# Altium schematic sheet A.SchDoc
size A2
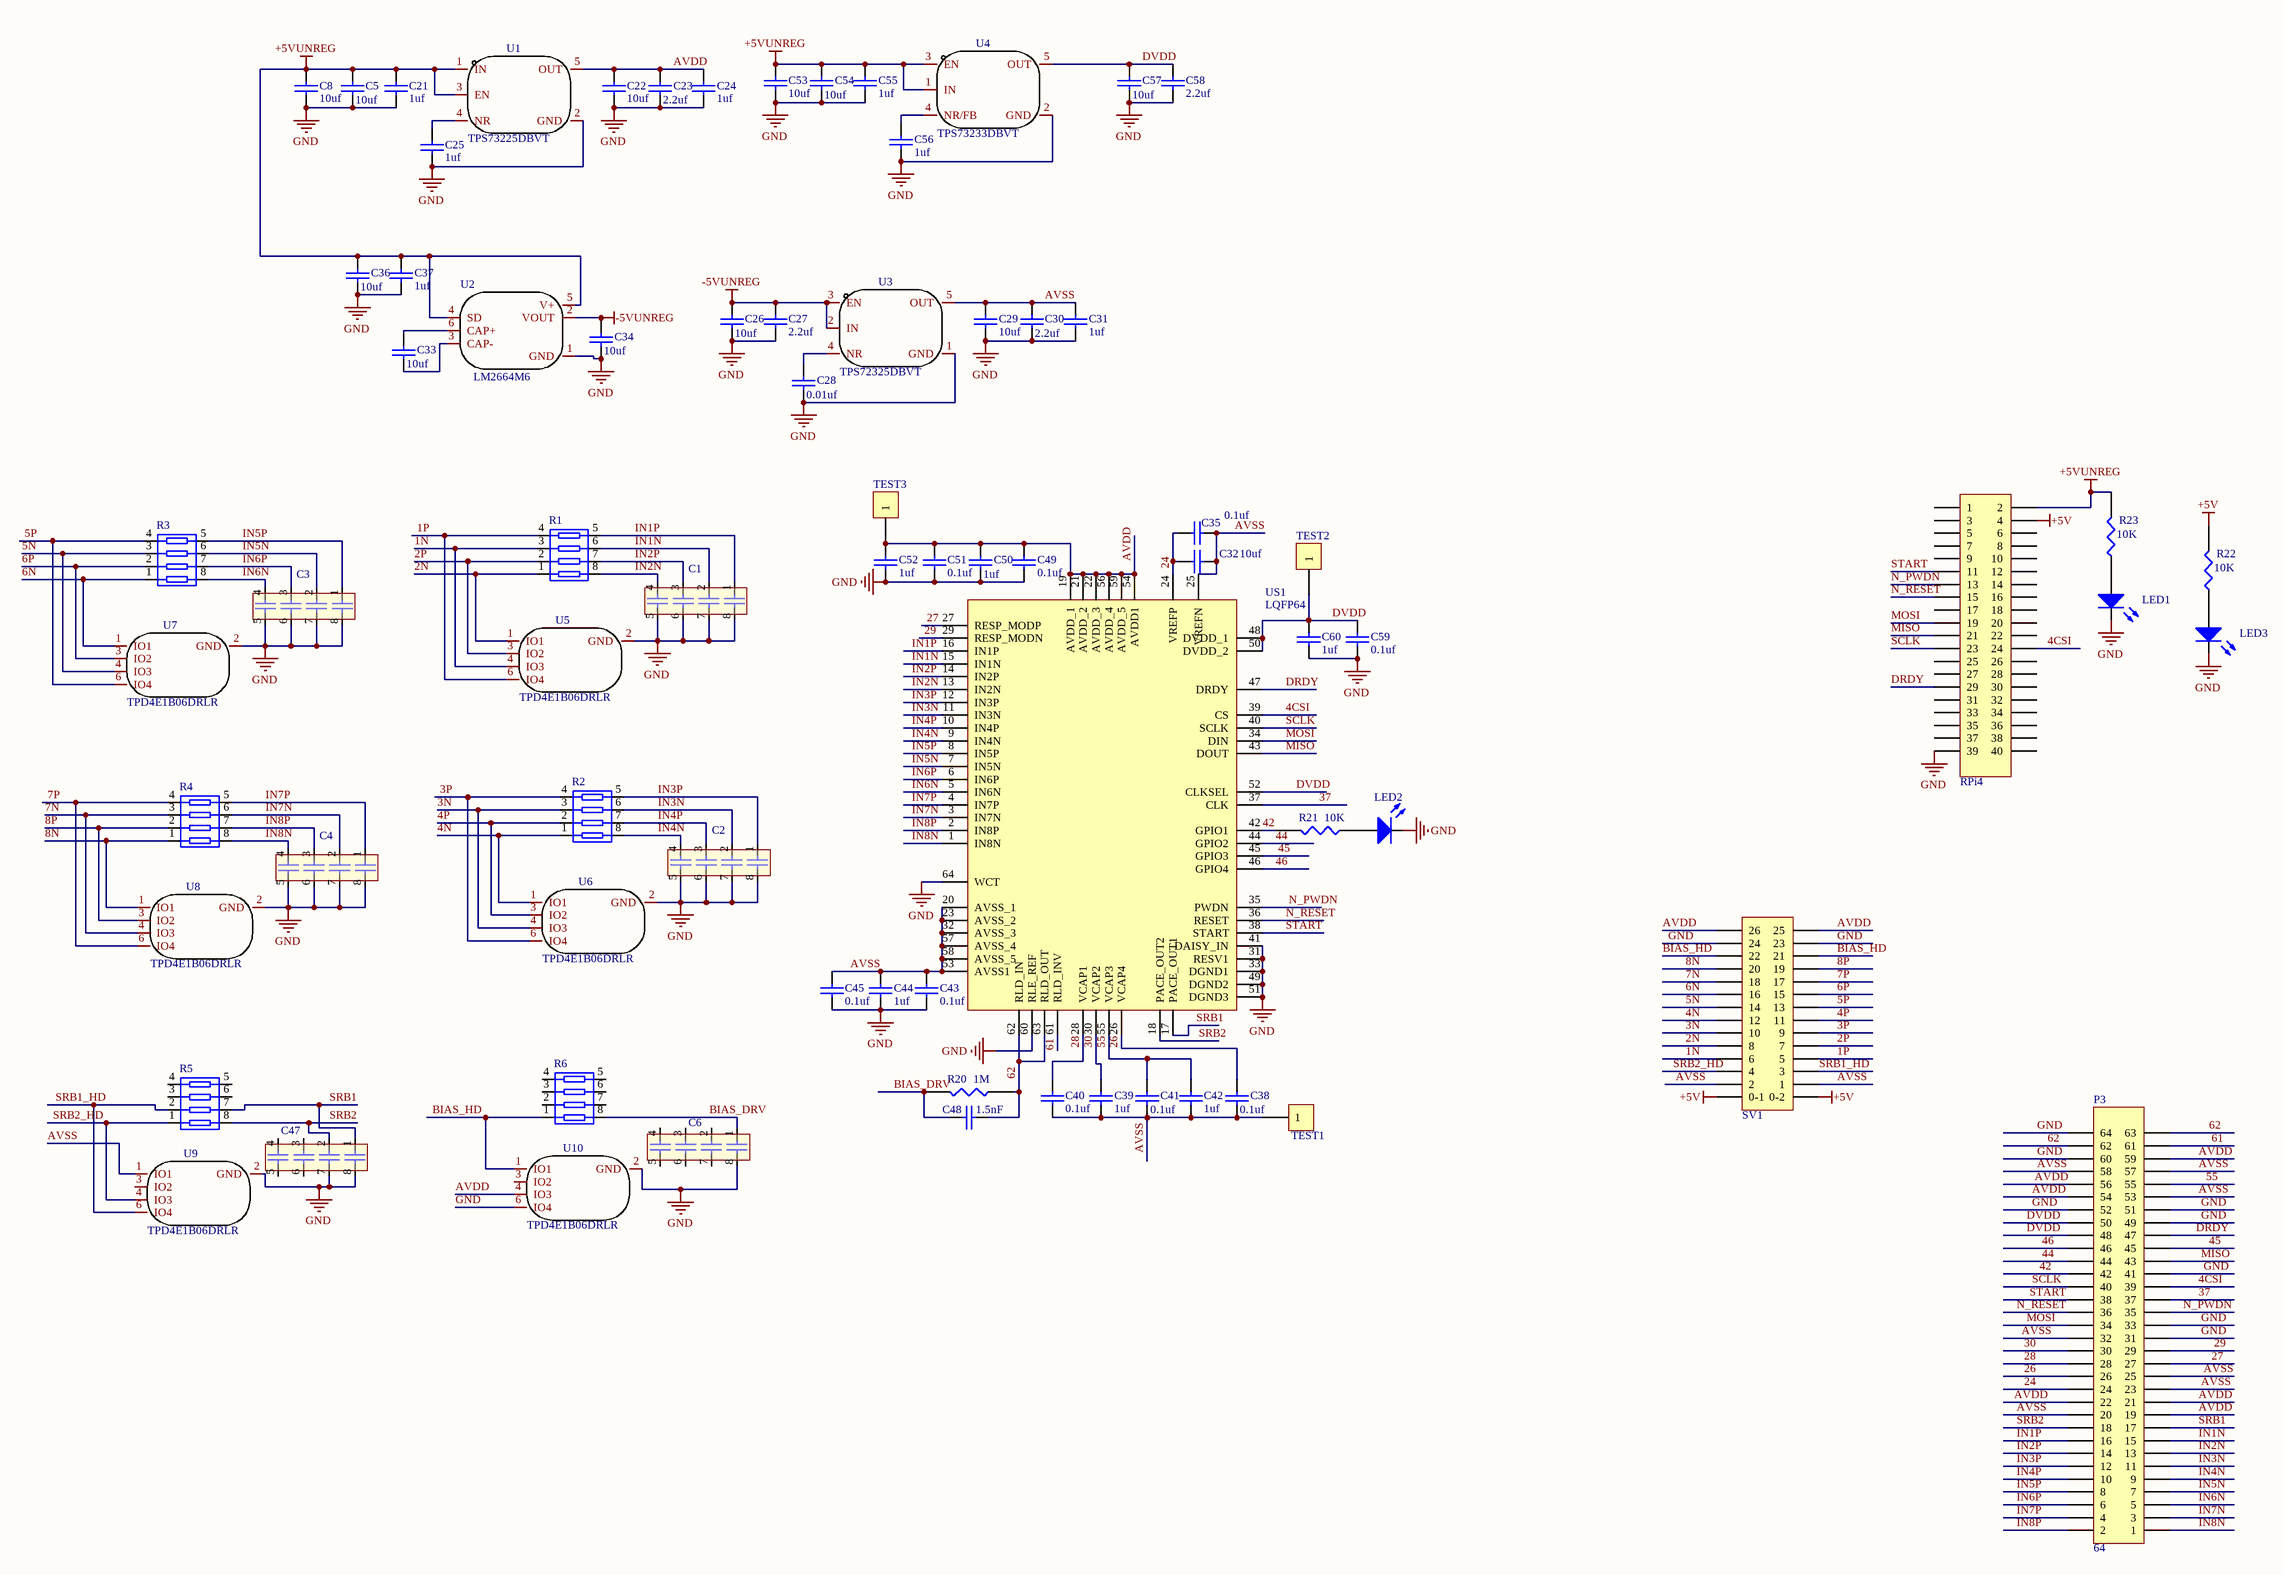
[diagram p0: A.SchDoc]

## Parts
C1  (no value)  [0805 array]
C2  (no value)  [0805 array]
C3  (no value)  [0805 array]
C4  (no value)  [0805 array]
C5  10uf  [0805]
C6  (no value)  [0805 array]
C8  10uf  [0805]
C21  1uf  [0805]
C22  10uf  [0805]
C23  2.2uf  [0805]
C24  1uf  [0805]
C25  1uf  [0805]
C26  10uf  [0805]
C27  2.2uf  [0805]
C28  0.01uf  [0805]
C29  10uf  [0805]
C30  2.2uf  [0805]
C31  1uf  [0805]
C32  10uf  [0805]
C33  10uf  [0805]
C34  10uf  [0805]
C35  0.1uf  [0805]
C36  10uf  [0805]
C37  1uf  [0805]
C38  0.1uf  [0805]
C39  1uf  [0805]
C40  0.1uf  [0805]
C41  0.1uf  [0805]
C42  1uf  [0805]
C43  0.1uf  [0805]
C44  1uf  [0805]
C45  0.1uf  [0805]
C47  (no value)  [0805 array]
C48  1.5nF  [0805]
C49  0.1uf  [0805]
C50  1uf  [0805]
C51  0.1uf  [0805]
C52  1uf  [0805]
C53  10uf  [0805]
C54  10uf  [0805]
C55  1uf  [0805]
C56  1uf  [0805]
C57  10uf  [0805]
C58  2.2uf  [0805]
C59  0.1uf  [0805]
C60  1uf  [0805]
LED1  (no value)  [0805]
LED2  (no value)  [0805]
LED3  (no value)  [0805]
P3  64  [64]
R1  (no value)  [8P4R]
R2  (no value)  [8P4R]
R3  (no value)  [8P4R]
R4  (no value)  [8P4R]
R5  (no value)  [8P4R]
R6  (no value)  [8P4R]
R20  1M  [0805]
R21  10K  [0805]
R22  10K  [0805]
R23  10K  [0805]
RPi4  RP13  [40]  (value not drawn)
SV1  SV1  [26]  (value not drawn)
TEST1  TEST2  [P]  (value not drawn)
TEST2  TEST3  [P]  (value not drawn)
TEST3  TEST4  [P]  (value not drawn)
U1  TPS73225DBVT  [sot23-5]
U2  LM2664M6  [sot23-6]
U3  TPS72325DBVT  [sot23-5]
U4  TPS73233DBVT  [sot23-5]
U5  TPD4E1B06DRLR  [sot563]
U6  TPD4E1B06DRLR  [sot563]
U7  TPD4E1B06DRLR  [sot563]
U8  TPD4E1B06DRLR  [sot563]
U9  TPD4E1B06DRLR  [sot563]
U10  TPD4E1B06DRLR  [sot563]
US1  LQFP64  [TQFP64]

## Nets
+5V: R22.2 RPi4.4 SV1.0-1 SV1.0-2
+5VUNREG: C5.1 C8.1 C21.1 C36.1 C37.1 C53.1 C54.1 C55.1 R23.2 RPi4.2 U1.1(IN) U1.3(EN) U2.4(SD) U2.5(V+) U4.1(IN) U4.3(EN)
-5VUNREG: C26.1 C27.1 C34.1 U2.2(VOUT) U3.2(IN) U3.3(EN)
GND: C1.5 C1.6 C1.7 C1.8 C2.5 C2.6 C2.7 C2.8 C3.5 C3.6 C3.7 C3.8 C4.5 C4.6 C4.7 C4.8 C5.2 C6.8 C8.2 C21.2 C22.2 C23.2 C24.2 C25.2 C26.2 C27.2 C28.2 C29.2 C30.2 C31.2 C34.2 C36.2 C37.2 C43.2 C44.2 C45.2 C47.7 C47.8 C49.2 C50.2 C51.2 C52.2 C53.2 C54.2 C55.2 C56.2 C57.2 C58.2 C59.1 C60.2 LED1.2(K) LED2.2(K) LED3.2(K) P3.31 P3.33 P3.41 P3.49 P3.51 P3.52 P3.60 P3.64 RPi4.39 SV1.23 SV1.24 U1.2(GND) U2.1(GND) U3.1(GND) U4.2(GND) U5.2(GND) U6.2(GND) U7.2(GND) U8.2(GND) U9.2(GND) U10.2(GND) U10.6(IO4) US1.31(RESV1) US1.33(DGND1) US1.41(DAISY_IN) US1.49(DGND2) US1.51(DGND3) US1.60(RLE_REF) US1.64(WCT)
1N: R1.3 SV1.6 U5.4(IO3)
1P: R1.4 SV1.5 U5.6(IO4)
2N: R1.1 SV1.8 U5.1(IO1)
2P: R1.2 SV1.7 U5.3(IO2)
3N: R2.3 SV1.10 U6.4(IO3)
3P: R2.4 SV1.9 U6.6(IO4)
4CSI: P3.39 RPi4.24 US1.39(CS)
4N: R2.1 SV1.12 U6.1(IO1)
4P: R2.2 SV1.11 U6.3(IO2)
5N: R3.3 SV1.14 U7.4(IO3)
5P: R3.4 SV1.13 U7.6(IO4)
6N: R3.1 SV1.16 U7.1(IO1)
6P: R3.2 SV1.15 U7.3(IO2)
7N: R4.3 SV1.18 U8.4(IO3)
7P: R4.4 SV1.17 U8.6(IO4)
8N: R4.1 SV1.20 U8.1(IO1)
8P: R4.2 SV1.19 U8.3(IO2)
24: C32.1 C35.2 P3.24 US1.24(VREFP)
26: C38.1 P3.26 US1.26(VCAP4)
27: P3.27 US1.27(RESP_MODP)
28: C40.1 P3.28 US1.28(VCAP1)
29: P3.29 US1.29(RESP_MODN)
30: C39.1 P3.30 US1.30(VCAP2)
37: P3.37 US1.37(CLK)
42: P3.42 R21.2 US1.42(GPIO1)
44: P3.44 US1.44(GPIO2)
45: P3.45 US1.45(GPIO3)
46: P3.46 US1.46(GPIO4)
55: C41.1 C42.1 P3.55 US1.55(VCAP3)
61: P3.61 US1.61(RLD_INV)
62: C48.2 P3.62 P3.63 R20.1 US1.62(RLD_IN) US1.63(RLD_OUT)
AVDD: C22.1 C23.1 C24.1 C49.1 C50.1 C51.1 C52.1 P3.19 P3.21 P3.22 P3.54 P3.56 P3.59 SV1.25 SV1.26 TEST3.1 U1.5(OUT) U10.4(IO3) US1.19(AVDD_1) US1.21(AVDD_2) US1.22(AVDD_3) US1.54(AVDD1) US1.56(AVDD_4) US1.59(AVDD_5)
AVSS: C29.1 C30.1 C31.1 C32.2 C35.1 C38.2 C39.2 C40.2 C41.2 C42.2 C43.1 C44.1 C45.1 P3.20 P3.23 P3.25 P3.32 P3.53 P3.57 P3.58 SV1.1 SV1.2 TEST1.1 U3.5(OUT) U9.1(IO1) US1.20(AVSS_1) US1.23(AVSS_2) US1.25(VREFN) US1.32(AVSS_3) US1.53(AVSS1) US1.57(AVSS_4) US1.58(AVSS_5)
BIAS_DRV: C6.1 C48.1 R6.8 R20.2
BIAS_HD: R6.1 SV1.21 SV1.22 U10.1(IO1)
DRDY: P3.47 RPi4.29 US1.47(DRDY)
DVDD: C57.1 C58.1 C59.2 C60.1 P3.48 P3.50 TEST2.1 U4.5(OUT) US1.48(DVDD_1) US1.50(DVDD_2) US1.52(CLKSEL)
IN1N: C1.2 P3.15 R1.6 US1.15(IN1N)
IN1P: C1.1 P3.16 R1.5 US1.16(IN1P)
IN2N: C1.4 P3.13 R1.8 US1.13(IN2N)
IN2P: C1.3 P3.14 R1.7 US1.14(IN2P)
IN3N: C2.2 P3.11 R2.6 US1.11(IN3N)
IN3P: C2.1 P3.12 R2.5 US1.12(IN3P)
IN4N: C2.4 P3.9 R2.8 US1.9(IN4N)
IN4P: C2.3 P3.10 R2.7 US1.10(IN4P)
IN5N: C3.2 P3.7 R3.6 US1.7(IN5N)
IN5P: C3.1 P3.8 R3.5 US1.8(IN5P)
IN6N: C3.4 P3.5 R3.8 US1.5(IN6N)
IN6P: C3.3 P3.6 R3.7 US1.6(IN6P)
IN7N: C4.2 P3.3 R4.6 US1.3(IN7N)
IN7P: C4.1 P3.4 R4.5 US1.4(IN7P)
IN8N: C4.4 P3.1 R4.8 US1.1(IN8N)
IN8P: C4.3 P3.2 R4.7 US1.2(IN8P)
MISO: P3.43 RPi4.21 US1.43(DOUT)
MOSI: P3.34 RPi4.19 US1.34(DIN)
N_PWDN: P3.35 RPi4.13 US1.35(PWDN)
N_RESET: P3.36 RPi4.15 US1.36(RESET)
SCLK: P3.40 RPi4.23 US1.40(SCLK)
SRB1: C47.1 P3.17 R5.7 US1.17(PACE_OUT1)
SRB1_HD: R5.2 SV1.3 U9.6(IO4)
SRB2: C47.2 P3.18 R5.8 US1.18(PACE_OUT2)
SRB2_HD: R5.1 SV1.4 U9.4(IO3)
START: P3.38 RPi4.11 US1.38(START)
NetC25_1: C25.1 U1.4(NR)
NetC28_1: C28.1 U3.4(NR)
NetC33_1: C33.1 U2.6(CAP+)
NetC33_2: C33.2 U2.3(CAP-)
NetC56_1: C56.1 U4.4(NR/FB)
NetLED1_1: LED1.1(A) R23.1
NetLED2_1: LED2.1(A) R21.1
NetLED3_1: LED3.1(A) R22.1

Not connected (* = marked no-connect by the designer): C6 2 3 4 5 6 7; C47 3 4 5 6; R5 3 4 5 6; R6 2 3 4 5 6 7; RPi4 1 3 5 6 7 8 9 10 12 14 16 17 18 20 22 25 26 27 28 30 31 32 33 34 35 36 37 38 40; U9 3(IO2); U10 3(IO2)

## Library data of the parts
C1-C4 C6 C47 R1-R6 = 8P4R: Loss Rate: 0.02; Code: *; Value: *
C5 C8 C21-C45 C48-C60 = CAP: Capacitor
LED1-LED3 = LED: Loss Rate: 0.02; Code: *; Value: *
R20-R23 = RES1
RPi4 = 40
SV1 = 26
TEST1-TEST3 = CON1: Connector
U1 U3 U4 = 5
U2 = 6
U5-U10 = 6+